# Altium schematic sheet Sheet2.SchDoc: *ESP8266 Wifi Module
size A4
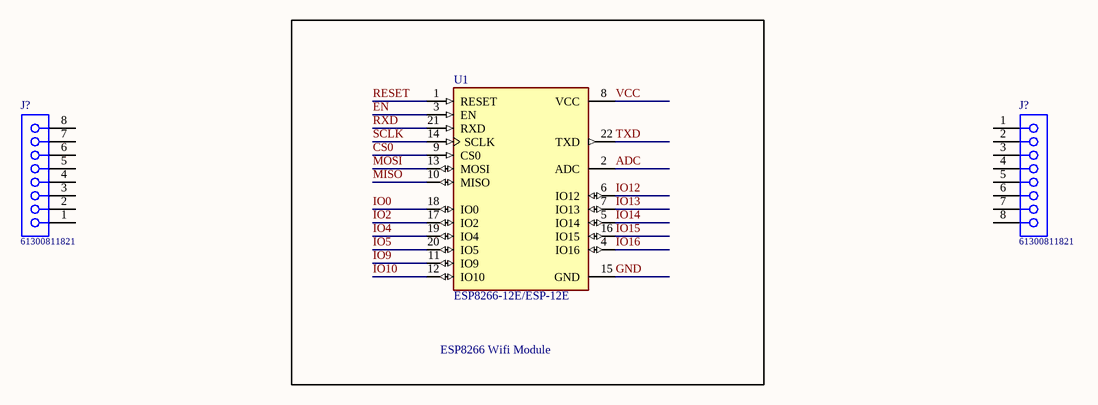
[diagram p0: Sheet2.SchDoc]

## Parts
(Parts that share a designator on the sheet are numbered #1, #2 ... from top to bottom, then left to right.)
J?#1  61300811821  [61300811821]
J?#2  61300811821  [61300811821]
U1  ESP8266-12E/ESP-12E  [XCVR_ESP8266-12E/ESP-12E]

## Blocks framed on the sheet
ESP8266 Wifi Module: U1

## Nets
ADC: U1.2(ADC)
CS0: U1.9(CS0)
EN: U1.3(EN)
GND: U1.15(GND)
IO0: U1.18(IO0)
IO2: U1.17(IO2)
IO4: U1.19(IO4)
IO5: U1.20(IO5)
IO9: U1.11(IO9)
IO10: U1.12(IO10)
IO12: U1.6(IO12)
IO13: U1.7(IO13)
IO14: U1.5(IO14)
IO15: U1.16(IO15)
IO16: U1.4(IO16)
MISO: U1.10(MISO)
MOSI: U1.13(MOSI)
RESET: U1.1(RESET)
RXD: U1.21(RXD)
SCLK: U1.14(SCLK)
TXD: U1.22(TXD)
VCC: U1.8(VCC)

Not connected (* = marked no-connect by the designer): J?#1 1 2 3 4 5 6 7 8; J?#2 1 2 3 4 5 6 7 8

## Notes on the sheet
- Title
- Size:
- Date:
- A4
- Number:
- Time:
- Revision:
- Sheet
- of
- File:

## Library data of the parts
J?#1 J?#2 = 61300811821: WR-PHD Socket Header, THT, pitch 2.54mm, Single Row, Vertical, 8p; Manufacturer: Wurth Elektronik; Pin Number: 8; Rated Current: 3A; Working Voltage: 250VAC; Withstanding Voltage: 500VAC; Contact Resistance: 20mOhm; ComponentLink1Description: Manufacturer; ComponentLink1URL: http://www.we-online.de; ComponentLink2Description: Datasheet; ComponentLink2URL: https://www.we-online.com/catalog/datasheet/61300811821.pdf; Manufacturer Part Number: 61300811821; Published Date: May 2020; Pitch: 2.54mm; Operating Temperature: -40 to +125degC; Mounting Technology: THT; Packaging: Tray; Gender: Socket Header; Row Number: Single; Orientation: Vertical
U1 = ESP8266-12E/ESP-12E: This WiFi module has a 32-bit MCU micro and clock speeds supporting 80 MHz or 160 MHz. Supports the RTOS and integrated Wi-Fi MAC/BB/RF/PA/LNA, and has an on-board antenna.; MF: AI-Thinker; Price: None; Package: None; Value: *; MP: ESP8266-12E/ESP-12E; Availability: Unavailable; SnapEDA_Link: https://www.snapeda.com/parts/ESP8266-12E/ESP-12E/AI-Thinker/view-part/106414/?ref=snap